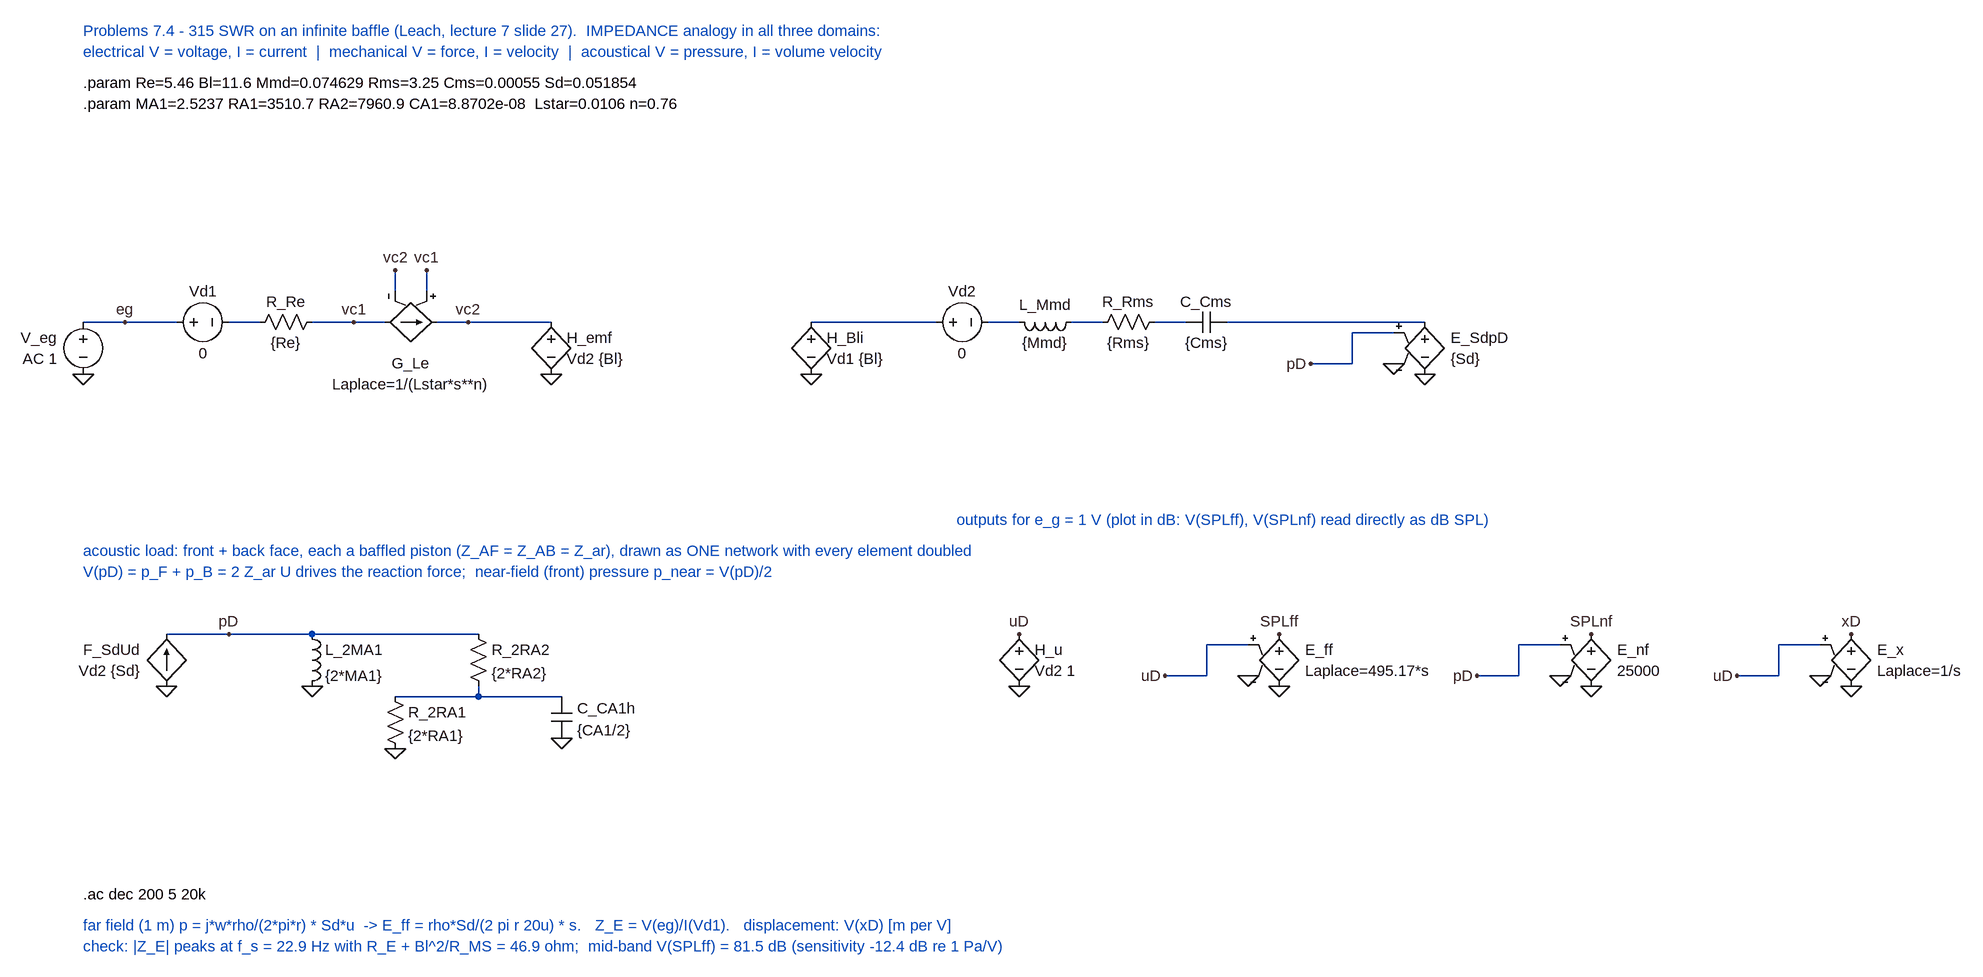
[diagram p0: schematic P7_315SWR_Baffle_LossyLe.asc]
P7_315SWR_Baffle_LossyLe.asc, the LTspice schematic file:
Version 4
SHEET 1 3000 1600
WIRE 0 0 144 0
WIRE 224 0 272 0
WIRE 352 0 416 0
WIRE 416 0 464 0
WIRE 528 -48 528 -80
WIRE 480 -48 480 -80
WIRE 544 0 592 0
WIRE 592 0 720 0
WIRE 1120 0 1312 0
WIRE 1392 0 1440 0
WIRE 1520 0 1568 0
WIRE 1648 0 1696 0
WIRE 1760 0 2064 0
WIRE 2016 16 1952 16
WIRE 1952 16 1952 64
WIRE 1952 64 1888 64
WIRE 128 480 608 480
WIRE 608 560 608 576
WIRE 480 576 736 576
WIRE 1792 496 1728 496
WIRE 1728 496 1728 544
WIRE 1728 544 1664 544
WIRE 2272 496 2208 496
WIRE 2208 496 2208 544
WIRE 2208 544 2144 544
WIRE 2672 496 2608 496
WIRE 2608 496 2608 544
WIRE 2608 544 2544 544
FLAG 0 80 0
FLAG 64 0 eg
FLAG 416 0 vc1
FLAG 528 -80 vc1
FLAG 480 -80 vc2
FLAG 592 0 vc2
FLAG 720 80 0
FLAG 1120 80 0
FLAG 2064 80 0
FLAG 2016 64 0
FLAG 1888 64 pD
FLAG 128 560 0
FLAG 224 480 pD
FLAG 352 560 0
FLAG 480 656 0
FLAG 736 640 0
FLAG 1440 560 0
FLAG 1440 480 uD
FLAG 1840 560 0
FLAG 1792 544 0
FLAG 1664 544 uD
FLAG 1840 480 SPLff
FLAG 2320 560 0
FLAG 2272 544 0
FLAG 2144 544 pD
FLAG 2320 480 SPLnf
FLAG 2720 560 0
FLAG 2672 544 0
FLAG 2544 544 uD
FLAG 2720 480 xD
SYMBOL voltage 0 -16 R0
WINDOW 0 -40 40 Right 2
WINDOW 3 -40 72 Right 2
SYMATTR InstName V_eg
SYMATTR Value AC 1
SYMBOL voltage 128 0 R270
WINDOW 0 32 56 VTop 2
WINDOW 3 -32 56 VBottom 2
SYMATTR InstName Vd1
SYMATTR Value 0
SYMBOL res 368 -16 R90
WINDOW 0 0 56 VBottom 2
WINDOW 3 32 56 VTop 2
SYMATTR InstName R_Re
SYMATTR Value {Re}
SYMBOL g 560 0 R90
WINDOW 0 48 56 VTop 2
WINDOW 3 80 56 VTop 2
SYMATTR InstName G_Le
SYMATTR Value Laplace=1/(Lstar*s**n)
SYMBOL h 720 -16 R0
WINDOW 0 24 40 Left 2
WINDOW 3 24 72 Left 2
SYMATTR InstName H_emf
SYMATTR Value Vd2 {Bl}
SYMBOL h 1120 -16 R0
WINDOW 0 24 40 Left 2
WINDOW 3 24 72 Left 2
SYMATTR InstName H_Bli
SYMATTR Value Vd1 {Bl}
SYMBOL voltage 1296 0 R270
WINDOW 0 32 56 VTop 2
WINDOW 3 -32 56 VBottom 2
SYMATTR InstName Vd2
SYMATTR Value 0
SYMBOL ind 1536 -16 R90
WINDOW 0 5 56 VBottom 2
WINDOW 3 32 56 VTop 2
SYMATTR InstName L_Mmd
SYMATTR Value {Mmd}
SYMATTR SpiceLine Rser=0
SYMBOL res 1664 -16 R90
WINDOW 0 0 56 VBottom 2
WINDOW 3 32 56 VTop 2
SYMATTR InstName R_Rms
SYMATTR Value {Rms}
SYMBOL cap 1760 -16 R90
WINDOW 0 0 32 VBottom 2
WINDOW 3 32 32 VTop 2
SYMATTR InstName C_Cms
SYMATTR Value {Cms}
SYMBOL e 2064 -16 R0
WINDOW 0 40 40 Left 2
WINDOW 3 40 72 Left 2
SYMATTR InstName E_SdpD
SYMATTR Value {Sd}
SYMBOL f 128 560 R180
WINDOW 0 40 56 Left 2
WINDOW 3 40 24 Left 2
SYMATTR InstName F_SdUd
SYMATTR Value Vd2 {Sd}
SYMBOL ind 336 464 R0
SYMATTR InstName L_2MA1
SYMATTR Value {2*MA1}
SYMATTR SpiceLine Rser=0
SYMBOL res 592 464 R0
SYMATTR InstName R_2RA2
SYMATTR Value {2*RA2}
SYMBOL res 464 560 R0
SYMATTR InstName R_2RA1
SYMATTR Value {2*RA1}
SYMBOL cap 720 576 R0
WINDOW 0 40 18 Left 2
WINDOW 3 40 52 Left 2
SYMATTR InstName C_CA1h
SYMATTR Value {CA1/2}
SYMBOL h 1440 464 R0
WINDOW 0 24 40 Left 2
WINDOW 3 24 72 Left 2
SYMATTR InstName H_u
SYMATTR Value Vd2 1
SYMBOL e 1840 464 R0
WINDOW 0 40 40 Left 2
WINDOW 3 40 72 Left 2
SYMATTR InstName E_ff
SYMATTR Value Laplace=495.17*s
SYMBOL e 2320 464 R0
WINDOW 0 40 40 Left 2
WINDOW 3 40 72 Left 2
SYMATTR InstName E_nf
SYMATTR Value 25000
SYMBOL e 2720 464 R0
WINDOW 0 40 40 Left 2
WINDOW 3 40 72 Left 2
SYMATTR InstName E_x
SYMATTR Value Laplace=1/s
TEXT 0 -448 Left 2 ;Problems 7.4 - 315 SWR on an infinite baffle (Leach, lecture 7 slide 27).  IMPEDANCE analogy in all three domains:
TEXT 0 -416 Left 2 ;electrical V = voltage, I = current  |  mechanical V = force, I = velocity  |  acoustical V = pressure, I = volume velocity
TEXT 0 -368 Left 2 !.param Re=5.46 Bl=11.6 Mmd=0.074629 Rms=3.25 Cms=0.00055 Sd=0.051854
TEXT 0 -336 Left 2 !.param MA1=2.5237 RA1=3510.7 RA2=7960.9 CA1=8.8702e-08  Lstar=0.0106 n=0.76
TEXT 0 352 Left 2 ;acoustic load: front + back face, each a baffled piston (Z_AF = Z_AB = Z_ar), drawn as ONE network with every element doubled
TEXT 0 384 Left 2 ;V(pD) = p_F + p_B = 2 Z_ar U drives the reaction force;  near-field (front) pressure p_near = V(pD)/2
TEXT 1344 304 Left 2 ;outputs for e_g = 1 V (plot in dB: V(SPLff), V(SPLnf) read directly as dB SPL)
TEXT 0 880 Left 2 !.ac dec 200 5 20k
TEXT 0 928 Left 2 ;far field (1 m) p = j*w*rho/(2*pi*r) * Sd*u  -> E_ff = rho*Sd/(2 pi r 20u) * s.   Z_E = V(eg)/I(Vd1).   displacement: V(xD) [m per V]
TEXT 0 960 Left 2 ;check: |Z_E| peaks at f_s = 22.9 Hz with R_E + Bl^2/R_MS = 46.9 ohm;  mid-band V(SPLff) = 81.5 dB (sensitivity -12.4 dB re 1 Pa/V)

The netlist it stands for:
* P7_315SWR_Baffle_LossyLe.asc
V_eg eg 0 AC 1
Vd1 eg N001 0
R_Re vc1 N001 {Re}
G_Le vc1 vc2 vc1 vc2 Laplace=1/(Lstar*s**n)
H_emf vc2 0 Vd2 {Bl}
H_Bli N002 0 Vd1 {Bl}
Vd2 N002 N003 0
L_Mmd N004 N003 {Mmd} Rser=0
R_Rms N005 N004 {Rms}
C_Cms N006 N005 {Cms}
E_SdpD N006 0 pD 0 {Sd}
F_SdUd 0 pD Vd2 {Sd}
L_2MA1 pD 0 {2*MA1} Rser=0
R_2RA2 pD N007 {2*RA2}
R_2RA1 N007 0 {2*RA1}
C_CA1h N007 0 {CA1/2}
H_u uD 0 Vd2 1
E_ff SPLff 0 uD 0 Laplace=495.17*s
E_nf SPLnf 0 pD 0 25000
E_x xD 0 uD 0 Laplace=1/s
* Problems 7.4 - 315 SWR on an infinite baffle (Leach, lecture 7 slide 27).  IMPEDANCE analogy in all three domains:
* electrical V = voltage, I = current  |  mechanical V = force, I = velocity  |  acoustical V = pressure, I = volume velocity
.param Re=5.46 Bl=11.6 Mmd=0.074629 Rms=3.25 Cms=0.00055 Sd=0.051854
.param MA1=2.5237 RA1=3510.7 RA2=7960.9 CA1=8.8702e-08  Lstar=0.0106 n=0.76
* acoustic load: front + back face, each a baffled piston (Z_AF = Z_AB = Z_ar), drawn as ONE network with every element doubled
* V(pD) = p_F + p_B = 2 Z_ar U drives the reaction force;  near-field (front) pressure p_near = V(pD)/2
* outputs for e_g = 1 V (plot in dB: V(SPLff), V(SPLnf) read directly as dB SPL)
.ac dec 200 5 20k
* far field (1 m) p = j*w*rho/(2*pi*r) * Sd*u  -> E_ff = rho*Sd/(2 pi r 20u) * s.   Z_E = V(eg)/I(Vd1).   displacement: V(xD) [m per V]
* check: |Z_E| peaks at f_s = 22.9 Hz with R_E + Bl^2/R_MS = 46.9 ohm;  mid-band V(SPLff) = 81.5 dB (sensitivity -12.4 dB re 1 Pa/V)
.backanno
.end